# EAGLE design Adafruit NeoTrellis 4x4 (EAGLE 9.1.1)
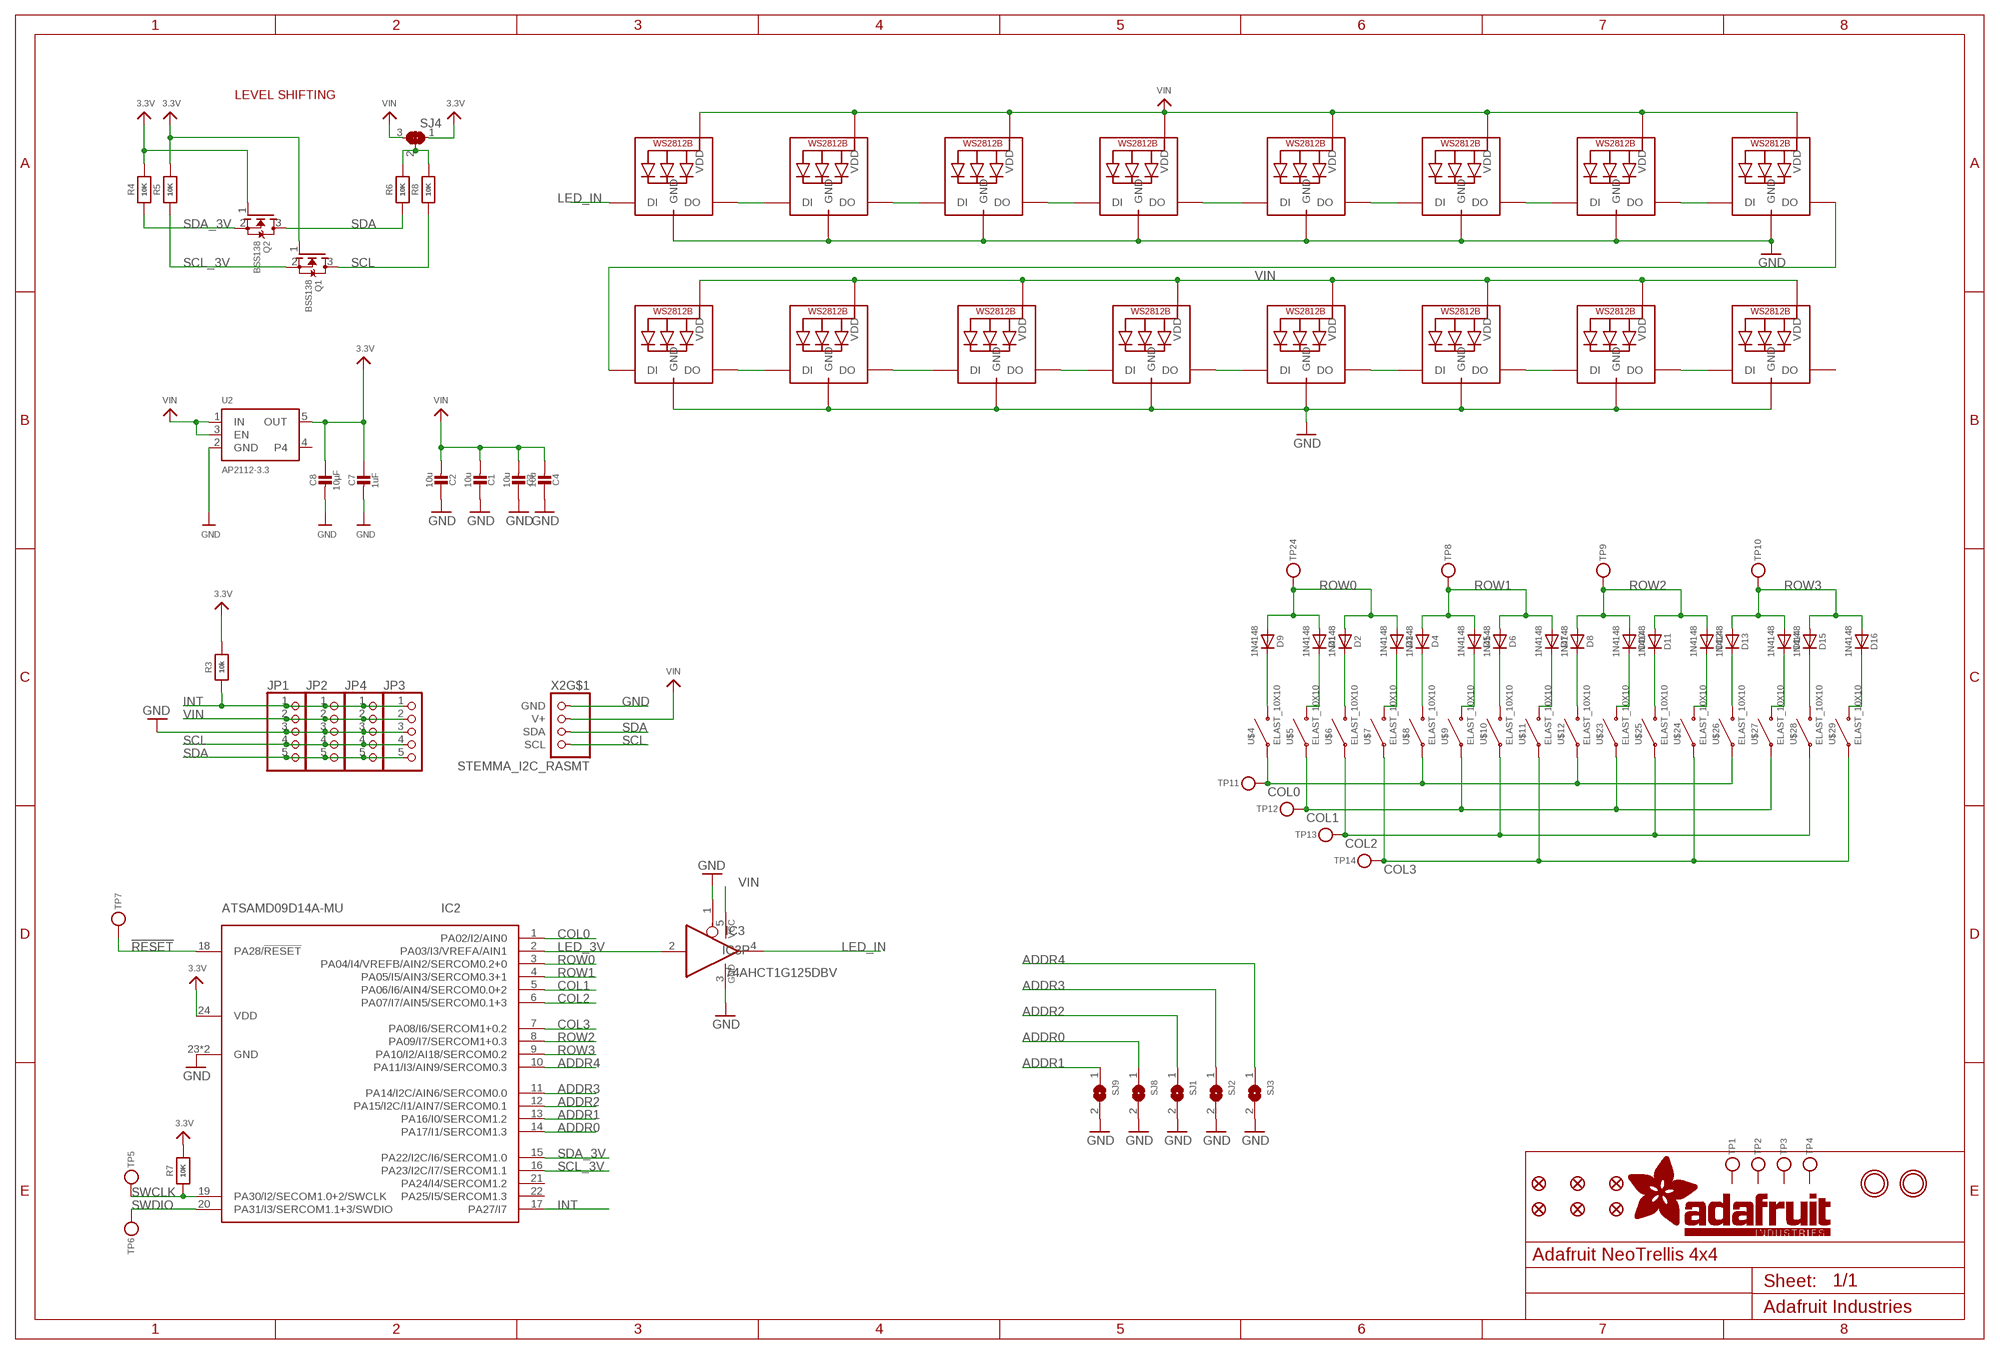
[diagram p0: schematic, sheet 1]

## Parts
C1  10u  CAP_CERAMIC0805-NOOUTLINE  [0805-NO]
C2  10u  CAP_CERAMIC0805-NOOUTLINE  [0805-NO]
C3  10u  CAP_CERAMIC0805-NOOUTLINE  [0805-NO]
C4  10u  CAP_CERAMIC0805-NOOUTLINE  [0805-NO]
C7  1uF  CAP_CERAMIC0603_NO  [0603-NO]
C8  10µF  CAP_CERAMIC0805-NOOUTLINE  [0805-NO]
D1  1N4148  DIODESOD-323  [SOD-323]
D2  1N4148  DIODESOD-323  [SOD-323]
D3  1N4148  DIODESOD-323  [SOD-323]
D4  1N4148  DIODESOD-323  [SOD-323]
D5  1N4148  DIODESOD-323  [SOD-323]
D6  1N4148  DIODESOD-323  [SOD-323]
D7  1N4148  DIODESOD-323  [SOD-323]
D8  1N4148  DIODESOD-323  [SOD-323]
D9  1N4148  DIODESOD-323  [SOD-323]
D10  1N4148  DIODESOD-323  [SOD-323]
D11  1N4148  DIODESOD-323  [SOD-323]
D12  1N4148  DIODESOD-323  [SOD-323]
D13  1N4148  DIODESOD-323  [SOD-323]
D14  1N4148  DIODESOD-323  [SOD-323]
D15  1N4148  DIODESOD-323  [SOD-323]
D16  1N4148  DIODESOD-323  [SOD-323]
FID1  FIDUCIAL_1MM  [FIDUCIAL_1MM]
FID2  FIDUCIAL_1MM  [FIDUCIAL_1MM]
FID3  FIDUCIAL_1MM  [FIDUCIAL_1MM]
FID4  FIDUCIAL_1MM  [FIDUCIAL_1MM]
FID5  FIDUCIAL_1MM  [FIDUCIAL_1MM]
FID6  FIDUCIAL_1MM  [FIDUCIAL_1MM]
IC2  ATSAMD09D14A-MU  [QFN24_4MM]
IC3  74AHCT1G125DBV  [SOT23-5]
JP1  HEADER-1X5EDGESMT  [5P_EDGECONNECT]
JP2  HEADER-1X5EDGESMT  [5P_EDGECONNECT]
JP3  HEADER-1X5EDGESMT  [5P_EDGECONNECT]
JP4  HEADER-1X5EDGESMT  [5P_EDGECONNECT]
LED1  WS2812B3535  [LED3535]
LED2  WS2812B3535  [LED3535]
LED3  WS2812B3535  [LED3535]
LED4  WS2812B3535  [LED3535]
LED5  WS2812B3535  [LED3535]
LED6  WS2812B3535  [LED3535]
LED7  WS2812B3535  [LED3535]
LED8  WS2812B3535  [LED3535]
LED9  WS2812B3535  [LED3535]
LED10  WS2812B3535  [LED3535]
LED11  WS2812B3535  [LED3535]
LED12  WS2812B3535  [LED3535]
LED13  WS2812B3535  [LED3535]
LED14  WS2812B3535  [LED3535]
LED15  WS2812B3535  [LED3535]
LED16  WS2812B3535  [LED3535]
Q1  BSS138  MOSFET-NWIDE  [SOT23-WIDE]
Q2  BSS138  MOSFET-NWIDE  [SOT23-WIDE]
R3  10k  RESISTOR_0603_NOOUT  [0603-NO]
R4  10K  RESISTOR_0603_NOOUT  [0603-NO]
R5  10K  RESISTOR_0603_NOOUT  [0603-NO]
R6  10K  RESISTOR_0603_NOOUT  [0603-NO]
R7  10K  RESISTOR_0603_NOOUT  [0603-NO]
R8  10K  RESISTOR_0603_NOOUT  [0603-NO]
SJ1  SOLDERJUMPER  [SOLDERJUMPER_ARROW_NOPASTE]
SJ2  SOLDERJUMPER  [SOLDERJUMPER_ARROW_NOPASTE]
SJ3  SOLDERJUMPER  [SOLDERJUMPER_ARROW_NOPASTE]
SJ4  SOLDERJUMPER_2WAY  [SOLDERJUMPER_2WAY_OPEN_NOPASTE]
SJ8  SOLDERJUMPER  [SOLDERJUMPER_ARROW_NOPASTE]
SJ9  SOLDERJUMPER  [SOLDERJUMPER_ARROW_NOPASTE]
TP1  TESTPOINT  [TESTPOINT_SMT]
TP2  TESTPOINT  [TESTPOINT_SMT]
TP3  TESTPOINT  [TESTPOINT_SMT]
TP4  TESTPOINT  [TESTPOINT_SMT]
TP5  TESTPOINTROUND2MM  [TESTPOINT_ROUND_2MM]
TP6  TESTPOINTROUND2MM  [TESTPOINT_ROUND_2MM]
TP7  TESTPOINTROUND1.5MM  [TESTPOINT_ROUND_1.5MM]
TP8  TESTPOINTROUND1.5MM  [TESTPOINT_ROUND_1.5MM]
TP9  TESTPOINTROUND1.5MM  [TESTPOINT_ROUND_1.5MM]
TP10  TESTPOINTROUND1.5MM  [TESTPOINT_ROUND_1.5MM]
TP11  TESTPOINTROUND1.5MM  [TESTPOINT_ROUND_1.5MM]
TP12  TESTPOINTROUND1.5MM  [TESTPOINT_ROUND_1.5MM]
TP13  TESTPOINTROUND1.5MM  [TESTPOINT_ROUND_1.5MM]
TP14  TESTPOINTROUND1.5MM  [TESTPOINT_ROUND_1.5MM]
TP24  TESTPOINTROUND1.5MM  [TESTPOINT_ROUND_1.5MM]
U2  AP2112-3.3  VREG_SOT23-5  [SOT23-5]
U$1  MOUNTINGHOLE2.5  [MOUNTINGHOLE_2.5_PLATED]
U$2  MOUNTINGHOLE2.5  [MOUNTINGHOLE_2.5_PLATED]
U$4  ELAST_10X10  [ELAST_PAD_SQUARE_10MM_4X4WIDE]
U$5  ELAST_10X10  [ELAST_PAD_SQUARE_10MM_4X4WIDE]
U$6  ELAST_10X10  [ELAST_PAD_SQUARE_10MM_4X4WIDE]
U$7  ELAST_10X10  [ELAST_PAD_SQUARE_10MM_4X4WIDE]
U$8  ELAST_10X10  [ELAST_PAD_SQUARE_10MM_4X4WIDE]
U$9  ELAST_10X10  [ELAST_PAD_SQUARE_10MM_4X4WIDE]
U$10  ELAST_10X10  [ELAST_PAD_SQUARE_10MM_4X4WIDE]
U$11  ELAST_10X10  [ELAST_PAD_SQUARE_10MM_4X4WIDE]
U$12  ELAST_10X10  [ELAST_PAD_SQUARE_10MM_4X4WIDE]
U$23  ELAST_10X10  [ELAST_PAD_SQUARE_10MM_4X4WIDE]
U$24  ELAST_10X10  [ELAST_PAD_SQUARE_10MM_4X4WIDE]
U$25  ELAST_10X10  [ELAST_PAD_SQUARE_10MM_4X4WIDE]
U$26  ELAST_10X10  [ELAST_PAD_SQUARE_10MM_4X4WIDE]
U$27  ELAST_10X10  [ELAST_PAD_SQUARE_10MM_4X4WIDE]
U$28  ELAST_10X10  [ELAST_PAD_SQUARE_10MM_4X4WIDE]
U$29  ELAST_10X10  [ELAST_PAD_SQUARE_10MM_4X4WIDE]
X2  STEMMA_I2C_RASMT  [JSTPH4]

## Nets
3.3V: C7.1 C8.1 IC2.24(VDD) Q1.1(G) Q2.1(G) R3.2 R4.2 R5.2 R7.2 SJ4.1 U2.5(OUT)
!RESET: IC2.18(PA28/!RESET) TP7.P$1
ADDR0: IC2.14(PA17/I1/SERCOM1.3) SJ8.1
ADDR1: IC2.13(PA16/I0/SERCOM1.2) SJ9.1
ADDR2: IC2.12(PA15/I2C/I1/AIN7/SERCOM0.1) SJ1.1
ADDR3: IC2.11(PA14/I2C/AIN6/SERCOM0.0) SJ2.1
ADDR4: IC2.10(PA11/I3/AIN9/SERCOM0.3) SJ3.1
COL0: IC2.1(PA02/I2/AIN0) TP11.P$1 U$4.P$1 U$8.P$1 U$12.P$1 U$26.P$1
COL1: IC2.5(PA06/I6/AIN4/SERCOM0.0+2) TP12.P$1 U$5.P$1 U$9.P$1 U$23.P$1 U$27.P$1
COL2: IC2.6(PA07/I7/AIN5/SERCOM0.1+3) TP13.P$1 U$6.P$1 U$10.P$1 U$25.P$1 U$28.P$1
COL3: IC2.7(PA08/I6/SERCOM1+0.2) TP14.P$1 U$7.P$1 U$11.P$1 U$24.P$1 U$29.P$1
GND: C1.1 C2.1 C3.1 C4.1 C7.2 C8.2 IC2.23(GND) IC2.THERM(GND) IC3.1(OE) IC3.3(GND) JP1.3 JP2.3 JP3.3 JP4.3 LED1.4(GND) LED2.4(GND) LED3.4(GND) LED4.4(GND) LED5.4(GND) LED6.4(GND) LED7.4(GND) LED8.4(GND) LED9.4(GND) LED10.4(GND) LED11.4(GND) LED12.4(GND) LED13.4(GND) LED14.4(GND) LED15.4(GND) LED16.4(GND) SJ1.2 SJ2.2 SJ3.2 SJ8.2 SJ9.2 U2.2(GND) X2.1(GND)
INT: IC2.17(PA27/I7) JP1.1 JP2.1 JP3.1 JP4.1 R3.1
LED_3V: IC2.2(PA03/I3/VREFA/AIN1) IC3.2(I)
LED_IN: IC3.4(O) LED1.1(DI)
N$1: R6.2 R8.2 SJ4.2
N$2: D9.C U$4.P$2
N$3: D1.C U$5.P$2
N$4: D2.C U$6.P$2
N$5: D3.C U$7.P$2
N$6: D4.C U$8.P$2
N$9: D5.C U$9.P$2
N$11: LED1.3(DO) LED2.1(DI)
N$12: LED2.3(DO) LED3.1(DI)
N$13: LED3.3(DO) LED4.1(DI)
N$14: LED4.3(DO) LED5.1(DI)
N$15: D6.C U$10.P$2
N$16: LED5.3(DO) LED6.1(DI)
N$17: LED6.3(DO) LED7.1(DI)
N$18: D7.C U$11.P$2
N$19: LED7.3(DO) LED8.1(DI)
N$20: D8.C U$12.P$2
N$21: LED8.3(DO) LED9.1(DI)
N$22: D10.C U$23.P$2
N$23: D11.C U$25.P$2
N$24: D12.C U$24.P$2
N$25: D13.C U$26.P$2
N$26: D14.C U$27.P$2
N$27: D15.C U$28.P$2
N$28: D16.C U$29.P$2
N$29: LED9.3(DO) LED10.1(DI)
N$30: LED10.3(DO) LED12.1(DI)
N$31: LED11.1(DI) LED12.3(DO)
N$32: LED11.3(DO) LED13.1(DI)
N$33: LED13.3(DO) LED14.1(DI)
N$34: LED14.3(DO) LED15.1(DI)
N$35: LED15.3(DO) LED16.1(DI)
ROW0: D1.A D2.A D3.A D9.A IC2.3(PA04/I4/VREFB/AIN2/SERCOM0.2+0) TP24.P$1
ROW1: D4.A D5.A D6.A D7.A IC2.4(PA05/I5/AIN3/SERCOM0.3+1) TP8.P$1
ROW2: D8.A D10.A D11.A D12.A IC2.8(PA09/I7/SERCOM1+0.3) TP9.P$1
ROW3: D13.A D14.A D15.A D16.A IC2.9(PA10/I2/AI18/SERCOM0.2) TP10.P$1
SCL: JP1.4 JP2.4 JP3.4 JP4.4 Q1.3(D) R8.1 X2.4(SCL)
SCL_3V: IC2.16(PA23/I2C/I7/SERCOM1.1) Q1.2(S) R5.1
SDA: JP1.5 JP2.5 JP3.5 JP4.5 Q2.3(D) R6.1 X2.3(SDA)
SDA_3V: IC2.15(PA22/I2C/I6/SERCOM1.0) Q2.2(S) R4.1
SWCLK: IC2.19(PA30/I2/SECOM1.0+2/SWCLK) R7.1 TP5.P$1
SWDIO: IC2.20(PA31/I3/SERCOM1.1+3/SWDIO) TP6.P$1
VIN [power]: C1.2 C2.2 C3.2 C4.2 IC3.5(VCC) JP1.2 JP2.2 JP3.2 JP4.2 LED1.2(VDD) LED2.2(VDD) LED3.2(VDD) LED4.2(VDD) LED5.2(VDD) LED6.2(VDD) LED7.2(VDD) LED8.2(VDD) LED9.2(VDD) LED10.2(VDD) LED11.2(VDD) LED12.2(VDD) LED13.2(VDD) LED14.2(VDD) LED15.2(VDD) LED16.2(VDD) SJ4.3 U2.1(IN) U2.3(EN) X2.2(V+)
Unconnected: IC2.21(PA24/I4/SERCOM1.2) IC2.22(PA25/I5/SERCOM1.3) LED16.3(DO) TP1.P$1 TP2.P$1 TP3.P$1 TP4.P$1 U2.4 X2.NC1(MT) X2.NC2(MT)

## Notes on the sheet
- LEVEL SHIFTING

## Library data of the parts
C1-C4 C7 C8 = microbuilder:CAP_CERAMIC: Ceramic Capacitors For new designs, use the packages preceded by an '_' character since they are more reliable: The following footprints should be used on most boards: _0402 - Standard footprint for regular board layouts _0603 - Standard footprint for regular board layouts _0805 - Standard footprint for regular board layouts _1206 - Standard footprint for regular board layouts For extremely tight-pitch boards where space is at a premium, the following 'micro-pitch' footprints can be used (smaller pads, no silkscreen outline, etc.): _0402MP - Micro-pitch footprint for very dense/compact boards _0603MP - Micro-pitch footprint for very dense/compact boards _0805MP - Micro-pitch footprint for very dense/compact boards _1206MP - Micro-pitch footprint for very dense/compact boards
D1-D16 = microbuilder:DIODE: Diode SMA Model Volts Amps Type Vf Ir Digikey # Notes SSA34-E3 40V 3A Schottky 480mV @ 3A 200uA @ 40V SSA34-E3/61TGITR-ND CDBA120-G 20V 1A Schottky 500mV @ 1A 500uA @ 20V 641-1014-6-ND REEL MBRA210 10V 2A Schottky 350mV @ 2A 700uA @ 10V MBRA210LT3 SOD-123 Model Volts Amps Type Vf Ir Order # Notes BAT54T1G 30V 200mA Schottky 800mV @ 200mA 2uA @ 25V BAT54T1GOSTR-ND B0530W 30V 500mA Schottky 430mV @ 500mA 130uA @ 30V B0530W-FDICT-ND REEL MBR120 20V 1A Schottky 340mV @ 1A MBR120VLSFT1GOSCT-ND SOD-323 Model Volts Amps Type Vf Ir Order # Notes PMEG2005EJ 20V 500mA Schottky 355mV @ 500mA 568-4110-1-ND ZLLS410 10V 570mA Schottky 380mV @ 570mA ZLLS410CT-ND 1N4148WS 75V 150mA Silicon/Simple 1V 1N4148WSFSCT-ND REEL SOD-523 Model Volts Amps Type Vf Ir Order # Notes BAT54XV2 30V 200mA Schottky 0.8V @ 100mA BAT54XV2CT-ND TB751S 30V 30mA Schottky RB751S-40TE61CT-ND SOT23-R/W (R = Solder Paste/Reflow Ovens, W = Hand-Soldering) Model Volts Amps Type Vf Ir Order # Notes BAT54FILM 40V 300mA Schottky 497-7162-1-ND POWERDI-5 Model Volts Amps Type Vf Ir Order # Notes PDS560 60V 5A Schottky 670mV @ 5A 150uA @ 60V PDS560DICT-ND
FID1-FID6 = microbuilder:FIDUCIAL: Fiducial Alignment Points Various fiducial points for machine vision alignment.; BOM: EXCLUDE
IC2 = microbuilder:ATSAMD09D14A
IC3 = 74xx-little-us:74*1G125: Single Bus Buffer Gate with 3-State Output
JP1-JP4 = microbuilder:HEADER-1X5: PIN HEADER
LED1-LED16 = microbuilder:WS2812B
Q1 Q2 = microbuilder:MOSFET-N: N-Channel Mosfet LEGEND VDS: Voltage Drain-Source ID: Drain Current RDS(ON): Drain-Source On-State Resistance VGS(TH): Gate-Source Threshold Voltage CISS: Drain-Source Input Capacitance SOT-23 Name VDS ID RDS(ON) VGS(TH) CISS Order Number 2N7002E 60V 260mA 2.5 Ohm 2.5V @ 250uA 26.7pF @ 25V 2N7002ET1GOSTR-ND BSH103 30V 850mA 400 mOhm 400mV @ 1mA 83pF @ 24V BSH103,235-ND BSS138 60V 320mA 1.6 Ohm 1.5V @ 250uA 50pF @ 10V Mouser: 771-BSS138PW115 DMN2075U-7 20V 4.2A 38 mOhm 1V @ 250 uA 594.3pF @ 10V DMN2075U-7DICT-ND * BSS138 good choice for I2C level-shifting POWERPAK 1212-8 Name VDS ID RDS(ON) VGS(TH) CISS Order Number Si7308DN 60V 6A 58 mOhm 3V @ 250uA 665pF @ 15V SI7308DN-T1-E3CT-ND
R3-R8 = microbuilder:RESISTOR: Resistors For new designs, use the packages preceded by an '_' character since they are more reliable: The following footprints should be used on most boards: _0402 - Standard footprint for regular board layouts _0603 - Standard footprint for regular board layouts _0805 - Standard footprint for regular board layouts _1206 - Standard footprint for regular board layouts For extremely tight-pitch boards where space is at a premium, the following 'micro-pitch' footprints can be used (smaller pads, no silkscreen outline, etc.): _0402MP - Micro-pitch footprint for very dense/compact boards _0603MP - Micro-pitch footprint for very dense/compact boards _0805MP - Micro-pitch footprint for very dense/compact boards _1206MP - Micro-pitch footprint for very dense/compact boards
SJ1-SJ3 SJ8 SJ9 = microbuilder:SOLDERJUMPER: SMD Solder JUMPER Solder the two pads together to create a connection, or remove the solder to break it. REFLOW - Use this footprint for solder paste and reflow ovens. WAVE - Use this footprint for hand-soldering (larger pads). CLOSED - Has a trace between the two pads to ensure it is closed by default. The trace needs to be cut to disable the jumper, and can be closed again by creating a solder bridge between the two pads.; BOM: EXCLUDE
SJ4 = microbuilder:SOLDERJUMPER_2WAY: 2-Way Solder Jumper
TP1-TP14 TP24 = microbuilder:TESTPOINT: Test Point Various test points for characterisation and PCB testing TESTPOINT_SMT - Compact Surface Mount Test Point [Digikey: 5016KTR-ND]
U2 = microbuilder:VREG_SOT23-5: SOT23-5 Fixed Voltage Regulators Part Current Out V Out V In V Dropout θJA (°C/W) TJ (°C) Digikey Part No. ADP121 150mA 3.3V 3.4-5.5V 0.09V @ 150mA -- -- ADP121-AUJZ33R7CT-ND ADP121 150mA 3.0V 3.1-5.5V 0.09V @ 150mA -- -- ADP121-AUJZ30R7CT-ND ADP122 300mA 3.3V 3.4-5.5V 0.085V @ 300mA -- -- ADP122AUJZ-3.3-R7CT-ND ADP1712 300mA 3.3V 3.5-5.5V 0.17V @ 300mA -- -- ADP1712AUJZ-3.3-R7TR-ND AP7311 (Low Cost) 150mA 3.3V 3.5-6V 0.15V @ 150mA -- -- AP7311-33WG-7DICT-ND LD39015M18R 150mA 1.8V 1.9V-5.5V 0.08V @ 100mA -- -- 497-6977-1-ND LP2985A-33DBVR 150mA 3.3V 3.3-16V 0.28V @ 150mA 206 150 296-18479-1-ND MCP1824T-3302E/OT 300mA 3.3V 3.5V-6V 0.2V @ 300mA -- -- MCP1824T-3302E/OTCT-ND MIC5205-2.5YM5 TR 150mA 2.5V 2.7-16V 0.165V @ 150mA -- -- 576-1257-2-ND MIC5205-3.0YM5 TR 150mA 3.0V 3.2V-16V 0.165V @ 150mA -- -- 576-1258-2-ND MIC5205-3.3YM5 TR 150mA 3.3V 3.5V-16V 0.165V @ 150mA -- -- 576-1259-2-ND TPS780330220 150mA 3.3V+2.2V 3.6-5.5V 250mV Max -- -- 296-23332-1-ND TDA3663/N1,135 100mA 3.3V 3.5-45V 0.18V @ 50mA -- -- 568-5343-1-ND Max operating temp can be calculated using θJA, TJ (max junction temperature), and power in watts. Set the "Maximum Ambient Temperature" until it reaches TJ ("Max Junction Temperature"), which is the absolute limit for safe use of the regulator: Heat Sink Temperature Calculator <http://www.daycounter.com/Calculators/Heat-Sink-Temperature-Calculator.phtml> For example, With 12V source into a 3.3V LP2985 and a 30mA load, we are dissipating (12V-3.3V) * 0.03A = 0.261W. With a θJA of 206 °C/W, a TJ of 150°C, and 261mW we can safely use the chip without a heat sink up to 75°C (=147.1°C Junction Temperature).
U$1 U$2 = microbuilder:MOUNTINGHOLE: Mounting Hole For #2 screws (0.086"/2.18mm width, 0.094"/2.4mm hole) use 2.5mm; BOM: EXCLUDE
U$4-U$12 U$23-U$29 = microbuilder:ELAST_10X10: 10mm x 10mm elastomer pad
X2 = microbuilder:STEMMA_I2C

## Net classes
1 power: width 0.406 mm
2 gnd: width 0.254 mm

## Board
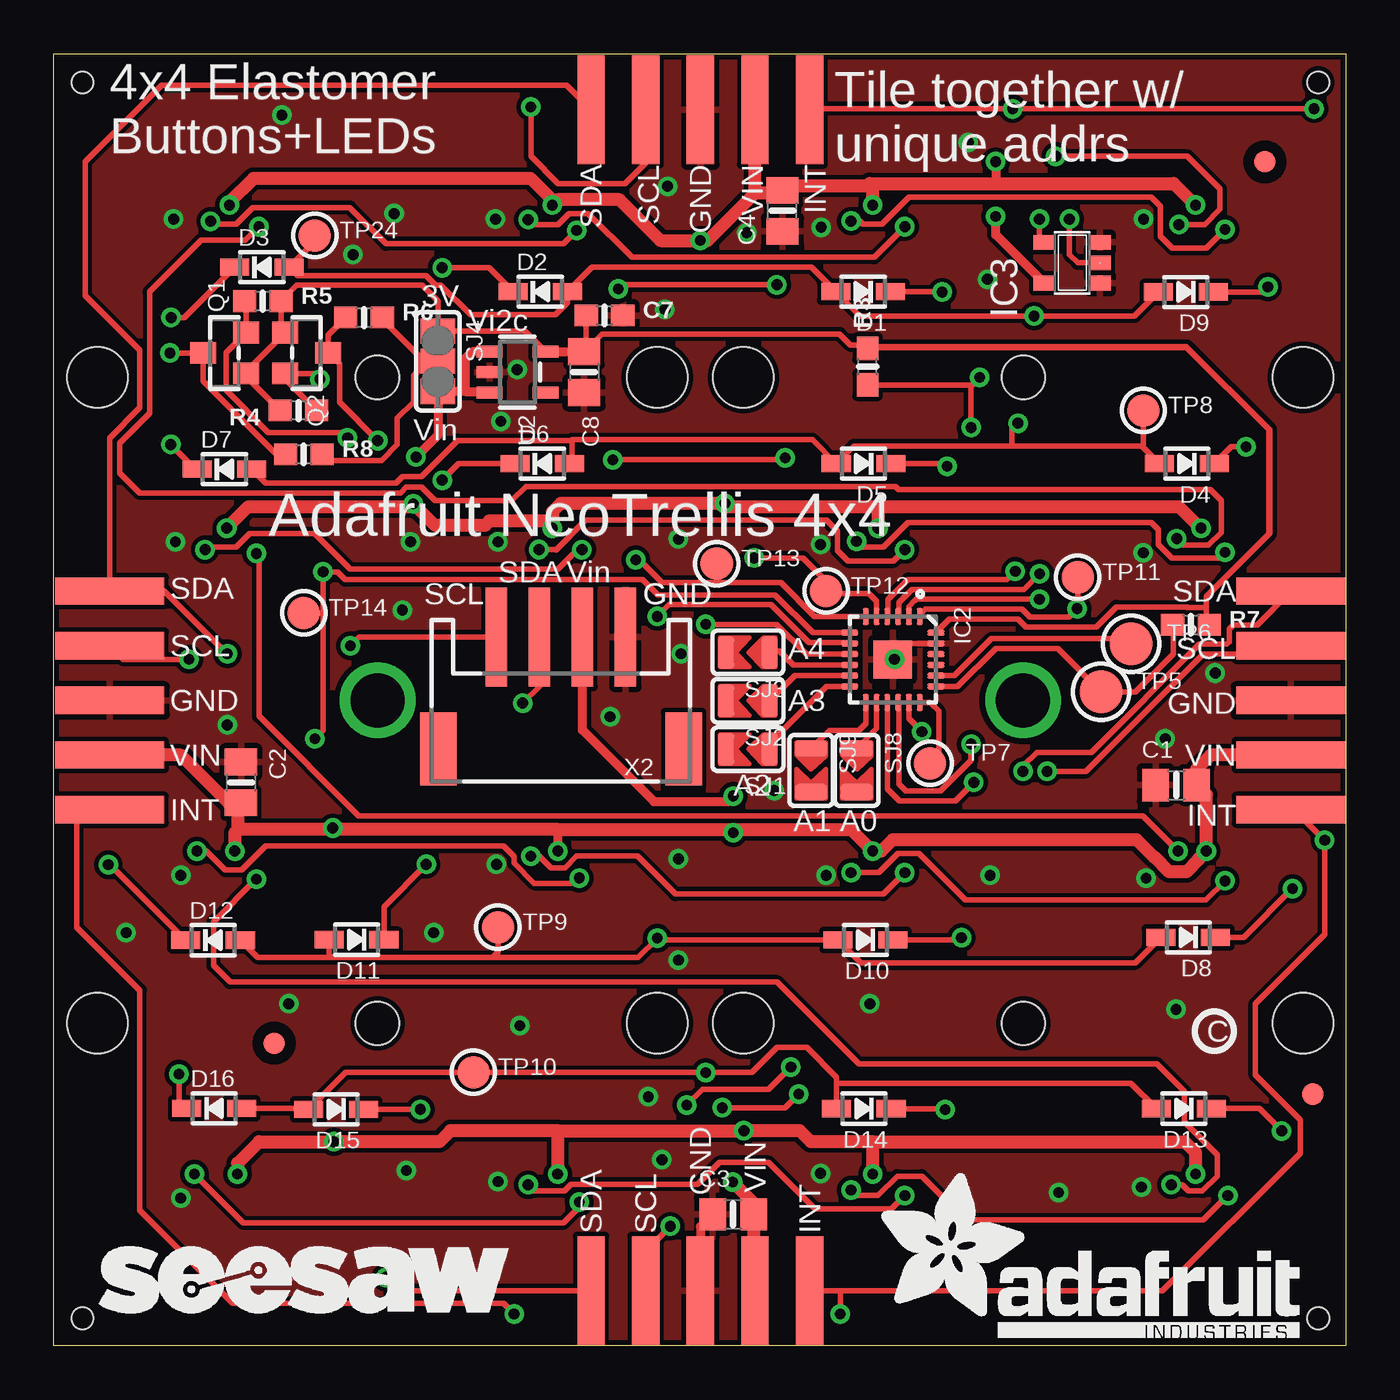
[diagram p1: board, top side]
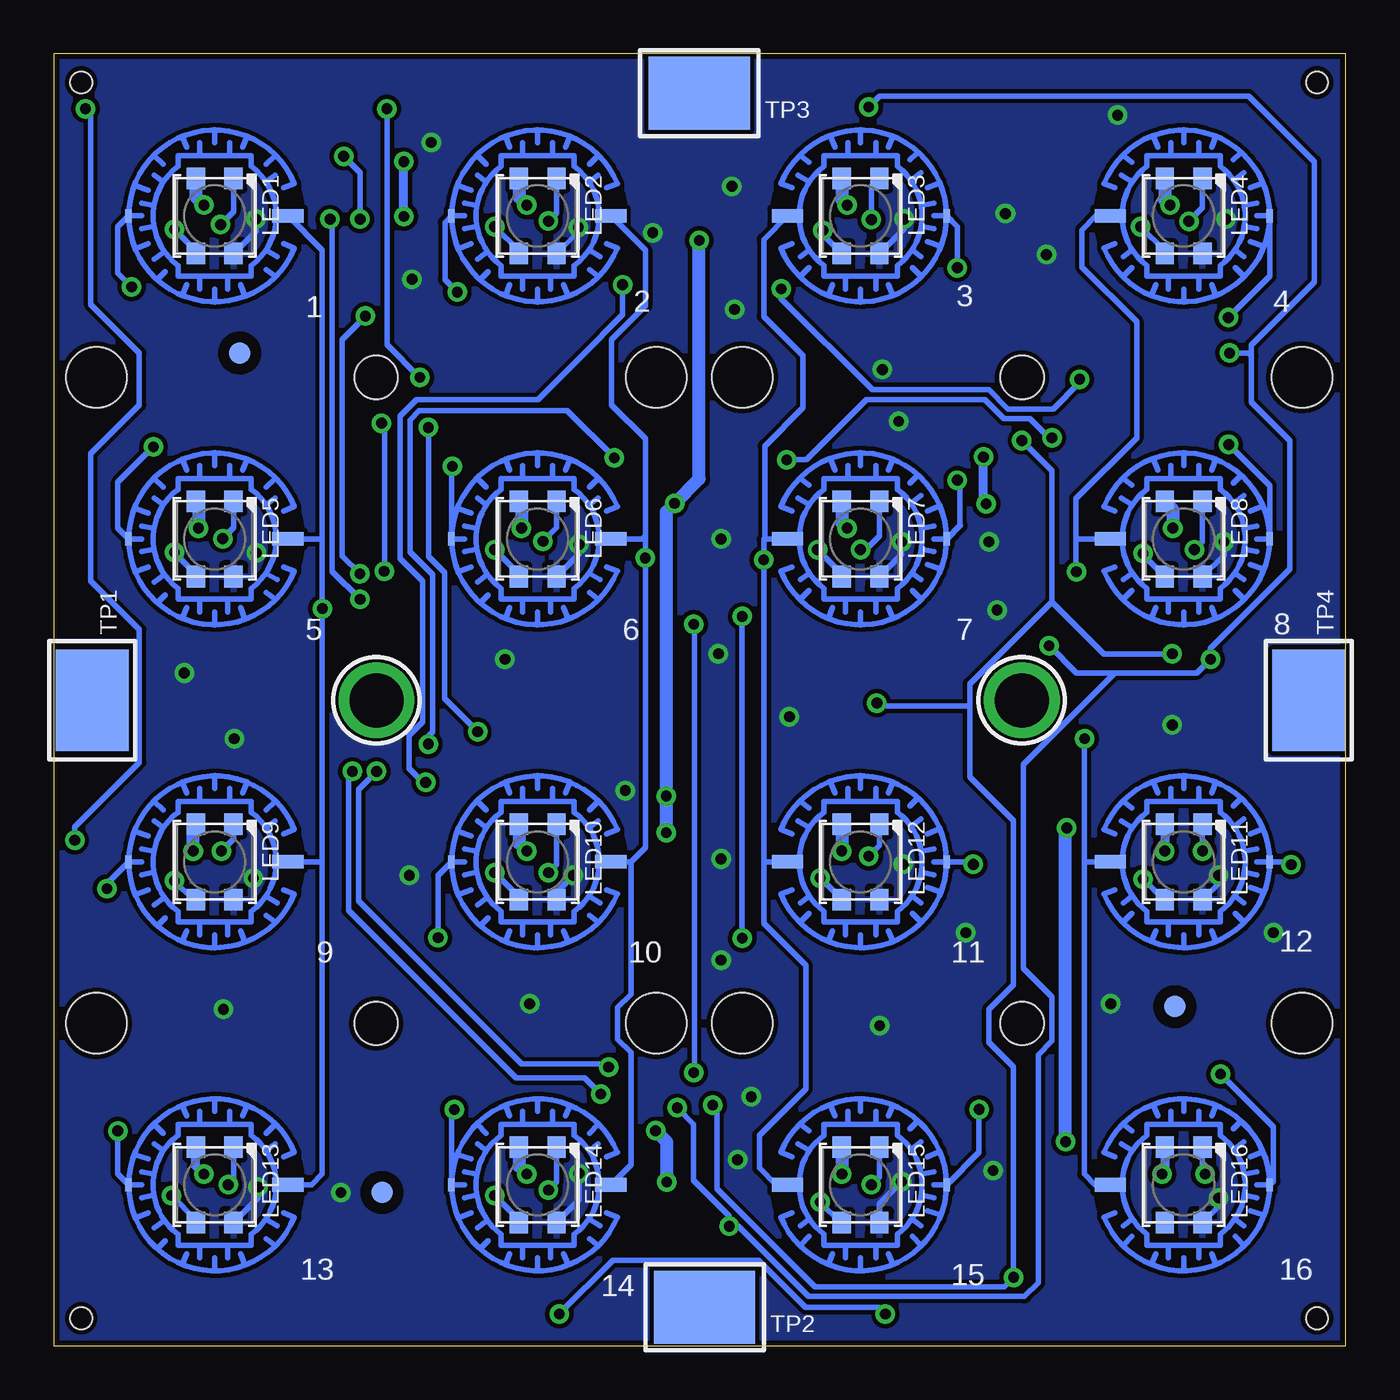
[diagram p2: board, bottom side, seen from below]

Size 60 x 60 mm. Coordinates in mm from the lower left corner, seen from the top.
Outline: 60,0 0,0 0,60 60,60 60,0
Copper layers (1*16): Top 0.035mm / dielectric 1.5mm / Bottom 0.035mm
Design rules "adafruit 88 *": minimum track width 8mil, minimum drill 15.5mil, track to track 8mil, track to pad 8mil, pad to pad 8mil, via to via 8mil, smd to smd 8mil, copper to edge 10mil, drill to drill 8mil, minimum pad ring 10mil, minimum via ring 8mil, stop-mask expansion 2mil, vias tented up to drill 20mil, thermal gap 10mil
Holes 2.8 mm at 2.03,44.97 28.03,44.97 32.03,44.97 58.03,44.97 2.03,14.97 28.03,14.97 32.03,14.97 58.03,14.97
Holes 2 mm at 15.03,44.97 45.03,44.97 15.03,14.97 45.03,14.97
Holes 1 mm at 1.33,58.67 58.73,58.67 1.33,1.27 58.73,1.27

### Footprints (pad centres in the part's own frame; a part is rotated, then mirrored left to right if it is on the bottom)
0805-NO = smd 1.24 x 1.5: 1 -0.95,0; 2 0.95,0
0603-NO = smd 1.075 x 1: 1 -0.85,0; 2 0.85,0
SOD-323 = smd 1.35 x 0.8: A 1.27,0; C -1.27,0
FIDUCIAL_1MM = smd 1 x 1: 1 0,0
QFN24_4MM = smd 0.8 x 0.28: 1 -2,1.25; 2 -2,0.75; 3 -2,0.25; 4 -2,-0.25; 5 -2,-0.75; 6 -2,-1.25; 13 2,-1.25; 14 2,-0.75; 15 2,-0.25; 16 2,0.25; 17 2,0.75; 18 2,1.25 | smd 0.28 x 0.8: 7 -1.25,-2; 8 -0.75,-2; 9 -0.25,-2; 10 0.25,-2; 11 0.75,-2; 12 1.25,-2; 19 1.25,2; 20 0.75,2; 21 0.25,2; 22 -0.25,2; 23 -0.75,2; 24 -1.25,2 | smd 1.778 x 1.778: THERM 0,0
SOT23-5 = smd 0.69 x 0.99: 1 -0.95,-1.29; 2 0,-1.29; 3 0.95,-1.29; 4 0.95,1.3; 5 -0.95,1.3
5P_EDGECONNECT = smd 1.27 x 5.08: 1 -5.08,0; 2 -2.54,0; 3 0,0; 4 2.54,0; 5 5.08,0
LED3535 = smd 1 x 0.85: 1 -1.75,0.875; 2 -1.75,-0.875; 3 1.75,-0.875; 4 1.75,0.875
SOT23-WIDE = smd 1 x 1.2: 1 -0.95,-1; 2 0.95,-1; 3 0,1
SOLDERJUMPER_ARROW_NOPASTE = smd 0.762 x 1.524: 1 -1.016,0; 2 1.016,0
SOLDERJUMPER_2WAY_OPEN_NOPASTE = smd 1.168 x 1.6: 1 -1.397,0; 2 0,0; 3 1.397,0
TESTPOINT_SMT = smd 4.7 x 3.4: P$1 0,0
TESTPOINT_ROUND_2MM = smd 2 x 2: P$1 0,0
TESTPOINT_ROUND_1.5MM = smd 1.5 x 1.5: P$1 0,0
SOT23-5' = smd 0.55 x 1.2: 1 -0.95,-1.3; 2 0,-1.3; 3 0.95,-1.3; 4 0.95,1.3; 5 -0.95,1.3
MOUNTINGHOLE_2.5_PLATED = drill 2.5 pad 3.2: P$1 0,0
ELAST_PAD_SQUARE_10MM_4X4WIDE = smd 1.45 x 0.635: P$1 -3.4,0 | smd 0.305 x 0.61: P$2 4,0
JSTPH4 = smd 1 x 4.6: 1 -3,-3.7; 2 -1,-3.7; 3 1,-3.7; 4 3,-3.7 | smd 1.7 x 3.4: NC1 -5.7,1.5; NC2 5.7,1.5

### Placement (x,y rotation side)
C1  52.13,26.04 0 top
C2  8.69,26.16 270 top
C3  31.55,6.1 0 top
C4  33.84,52.7 90 top
C7  25.58,47.85 0 top
C8  24.63,45.22 270 top
D1  37.59,48.95 180 top
D2  22.59,48.95 0 top
D3  9.66,50.09 0 top
D4  52.62,40.96 180 top
D5  37.61,40.96 180 top
D6  22.69,40.96 0 top
D7  7.92,40.71 0 top
D8  52.68,18.97 180 top
D9  52.58,48.94 180 top
D10  37.7,18.84 180 top
D11  14.06,18.86 180 top
D12  7.4,18.83 0 top
D13  52.48,11.01 180 top
D14  37.62,11.01 180 top
D15  13.11,10.98 180 top
D16  7.45,11.02 0 top
FID1  10.23,14.05 0 top
FID2  58.48,11.68 0 top
FID3  56.25,54.98 0 top
FID4  51.36,46.1 0 bottom
FID5  44.76,7.11 0 bottom
FID6  7.93,15.75 0 bottom
IC2  38.96,31.87 270 top
IC3  47.3,50.29 90 top
JP1  2.6,29.97 90 top
JP2  57.46,29.97 90 top
JP3  30.03,2.54 180 top
JP4  30.03,57.4 180 top
LED1  52.53,52.47 270 bottom
LED2  37.53,52.47 270 bottom
LED3  22.53,52.47 270 bottom
LED4  7.53,52.47 270 bottom
LED5  52.53,37.47 270 bottom
LED6  37.53,37.47 270 bottom
LED7  22.53,37.47 270 bottom
LED8  7.53,37.47 270 bottom
LED9  52.53,22.47 270 bottom
LED10  37.53,22.47 270 bottom
LED11  7.53,22.47 270 bottom
LED12  22.53,22.47 270 bottom
LED13  52.53,7.47 270 bottom
LED14  37.53,7.47 270 bottom
LED15  22.53,7.47 270 bottom
LED16  7.53,7.47 270 bottom
Q1  7.93,46.1 90 top
Q2  11.74,46.1 270 top
R3  37.8,45.47 90 top
R4  11.36,43.43 180 top
R5  9.71,48.51 0 top
R6  14.41,47.75 0 top
R7  52.81,33.48 0 top
R8  11.61,41.4 0 top
SJ1  32.23,27.71 180 top
SJ2  32.23,29.96 180 top
SJ3  32.23,32.2 180 top
SJ4  17.84,45.72 270 top
SJ8  37.29,26.72 270 top
SJ9  35.17,26.72 270 top
TP1  58.22,29.97 90 bottom
TP2  29.77,1.78 0 bottom
TP3  30.03,58.17 0 bottom
TP4  1.71,29.97 90 bottom
TP5  48.64,30.37 0 top
TP6  50.04,32.61 0 top
TP7  40.7,27.05 0 top
TP8  50.6,43.43 0 top
TP9  20.63,19.43 0 top
TP10  19.49,12.7 0 top
TP11  47.55,35.69 0 top
TP12  35.87,35.05 0 top
TP13  30.79,36.32 0 top
TP14  11.61,34.04 0 top
TP24  12.12,51.56 0 top
U2  AP2112-3.3  [SOT23-5']  21.53,45.22 270 top
U$1  45.01,29.97 0 bottom
U$2  15.04,29.97 0 bottom
U$3  [ADAFRUIT_TEXT_20MM]  38.28,0.38 0 top
U$4  52.53,52.47 180 bottom
U$5  37.53,52.47 180 bottom
U$6  22.53,52.47 0 bottom
U$7  7.53,52.47 0 bottom
U$8  52.53,37.47 180 bottom
U$9  37.53,37.47 180 bottom
U$10  22.53,37.47 0 bottom
U$11  7.53,37.47 0 bottom
U$12  52.53,22.47 180 bottom
U$14  [SEESAW_LOGO]  2.09,1.52 0 top
U$19  [PCBFEAT-REV-040]  53.9,14.61 0 top
U$23  37.53,22.47 180 bottom
U$24  7.53,22.47 0 bottom
U$25  22.53,22.47 0 bottom
U$26  52.53,7.47 180 bottom
U$27  37.53,7.47 180 bottom
U$28  22.53,7.47 0 bottom
U$29  7.53,7.47 0 bottom
X2  23.55,29.21 180 top

### Tracks (layer width: path | path; a pad name or v marks a point on that pad's centre or on a via)
3.3V
  Top 0.203: R3.2 37.85,46.38 38.03,46.38
  Top 0.254: R4.2 8.93,45.01 Q1.1 8.84,45.15 Q2.1 10.56,47.23 R5.2 11.29,49.25 17.09,49.25 17.84,48.5 SJ4.1 | IC2.24 41.6,33.76 44.77,33.76 45.14,33.39 48.42,33.39 49.35,34.31 52.63,34.31 52.65,34.29 53.52,34.29 | U2.5 21.89,47.12 SJ4.1 | C7.1 24.73,46.27 C8.1 25.45,46.99 36.49,46.99 37.01,46.48 37.64,46.48 | SJ4.1 17.84,45.97 | 53.52,34.29 53.52,33.62 R7.2 | 54.27,35.54 53.52,34.79 53.52,34.29
  Top 0.305: 54.27,35.54 56.44,37.71 56.44,42.55 52.61,46.38 38.03,46.38 37.74,46.38 37.64,46.48
  Top 0.406: U2.5 C8.1
!RESET
  Top 0.254: IC2.18 40.7,29.87 41.1,29.47 41.1,27.45 TP7.P$1
ADDR0
  Top 0.254: IC2.14 38.21,28.66 SJ8.1
ADDR1
  Top 0.254: IC2.13 37.71,28.9 37.39,28.58 36.01,28.58 SJ9.1
ADDR2
  Top 0.254: IC2.12 35.88,30.62 33.25,27.99 SJ1.1
ADDR3
  Top 0.254: IC2.11 34.41,31.12 SJ2.1
ADDR4
  Top 0.254: IC2.10 34.35,31.62 33.71,32.26 33.31,32.26 SJ3.1
COL0  (via drill 0.5)
  Top 0.254: IC2.1 40.21,33.94 40.49,34.21 44.96,34.21 45.33,33.84 47.14,33.84 v47.53,34.23 47.55,34.26 TP11.P$1
  Bottom 0.254: U$4.P$1 47.53,50.87 47.53,37.47 | 47.53,37.47 v47.53,34.23 47.53,22.47 | 47.53,22.47 47.53,7.97 48.03,7.47 U$26.P$1 | U$12.P$1 47.53,22.47 | U$8.P$1 47.53,37.47
COL1  (via drill 0.5)
  Top 0.254: IC2.5 38.21,34.58 37.87,34.93 36.45,34.93 36.32,35.05 | v32.53,36.58 34.79,36.58 36.32,35.05 | TP12.P$1 36.32,35.05
  Bottom 0.254: U$5.P$1 32.53,50.87 32.53,48.3 34.09,46.74 34.09,43.69 32.53,42.12 32.53,37.59 | U$23.P$1 33.2,22.47 | 33.2,22.47 33.2,16.32 33.81,15.71 33.81,14.23 33.2,13.63 33.2,8.4 U$27.P$1 | 33.2,22.47 32.53,23.15 v32.53,36.58 32.53,37.59 | U$9.P$1 32.65,37.47 32.53,37.59
COL2  (via drill 0.5)
  Top 0.254: IC2.6 35.34,33.87 33.77,35.43 30.92,35.43 | 30.92,35.43 28.25,35.43 27.18,36.5 v27.03,36.5 | TP13.P$1 30.79,35.56 30.92,35.43
  Bottom 0.254: U$6.P$1 27.03,51.37 27.03,47.8 25.2,45.97 25.2,43.56 26.98,41.78 26.98,37.52 27.03,37.47 | 27.03,37.47 v27.03,36.5 27.03,22.47 | U$10.P$1 27.03,37.47 | U$25.P$1 27.03,22.47 | U$28.P$1 26.45,7.47 27.23,8.26 27.23,9.78 25.07,11.94 25.07,17.65 27.03,19.61 27.03,22.47
COL3  (via drill 0.5)
  Top 0.254: v12.12,28.19 12.5,28.58 12.5,33.91 | 12.5,33.91 v12.5,35.94 13.18,35.94 13.54,35.58 27.34,35.58 28.05,34.87 33.5,34.87 35.25,33.12 IC2.7 | TP14.P$1 12.38,34.04 12.5,33.91
  Bottom 0.254: 12.15,22.47 12.15,7.97 11.65,7.47 U$29.P$1 | U$11.P$1 12.53,37.47 | U$24.P$1 12.15,22.47 | U$7.P$1 11.59,52.47 12.25,51.82 12.25,50.09 9.71,47.55 9.71,42.16 12.53,39.34 12.53,37.47 | 12.53,37.47 12.53,35.97 v12.5,35.94 | 12.15,22.47 12.15,28.17 v12.12,28.19
GND  (via drill 0.5)
  Top 0.254: IC2.23 39.79,32.62 v39.05,31.88
  Top 0.406: C3.1 30.03,5.53 JP3.3
  Bottom 0.203: LED2.4 35.64,51.74 v35.64,51.94
  Bottom 0.254: LED10.4 36.65,21.06 v35.87,21.84 | LED16.4 5.9,6.48 v5.9,6.86 | LED15.4 21.65,6.6 v20.63,7.62 | LED8.4 5.64,36.73 v5.64,37.34 | LED7.4 20.63,36.75 v20.63,37.34 | LED1.4 50.61,51.76 v50.61,52.32 | LED3.4 20.51,51.86 v20.51,52.32 | LED11.4 5.9,21.48 v5.9,21.84 | LED14.4 35.61,6.76 v35.61,8 | LED13.4 50.51,6.86 v50.51,7.37 | LED6.4 35.61,36.76 v35.61,37.21
  other vias: 28.5,53.85 42.47,55.88 50.73,21.72 5.56,52.32 20.56,22.35 43.36,49.53 21.52,45.34 17.64,19.18 16.37,8.13 10.91,15.88 16.57,37.34 25.84,29.21 16.18,34.16 33.46,25.78 29.01,22.61 20.76,42.93 53.94,31.24 43.49,21.84 46.66,7.11 29.13,32.13 29.01,37.47 32.19,51.69 15.8,52.58 13.9,50.67 3.36,19.18 8.06,28.83 28.25,8.64 27.61,11.56 37.9,15.88 52.13,15.62 51.62,28.19 21.65,14.86 28.39,48.13 50.6,36.83 29.01,17.91 10.6,57.15
  pour Top: 60.51,60.45 -0.45,60.45 -0.45,-0.51 60.51,-0.51
  pour Bottom: 60.51,60.45 -0.45,60.45 -0.45,-0.51 60.51,-0.51
INT  (via drill 0.5)
  Top 0.254: JP3.1 36.53,2.54 | 36.53,2.54 51.49,2.54 57.89,8.94 57.89,10.49 55.81,12.57 55.81,15.88 59.03,19.09 v59.03,23.47 57.61,24.89 JP2.1 | v36.53,1.47 36.53,2.54 | v58.53,57.45 v44.53,57.45 35.15,57.45 JP4.1 | IC2.17 39.71,29.12 v40.31,28.52 | R3.1 42.65,44.62 | 42.65,44.62 v43,44.97 | v21.38,1.47 20.88,1.97 8.31,1.97 3.99,6.29 3.99,16.51 1.07,19.43 1.07,24.26 1.71,24.89 JP1.1 | v42.6,42.65 42.6,44.57 42.65,44.62
  Bottom 0.254: v36.53,1.47 34.03,3.97 27.27,3.97 25.08,1.78 21.68,1.78 v21.38,1.47 | v44.53,57.45 44.53,46.5 v43,44.97 | v58.53,57.45 58.29,57.21 58.29,48.36 56.03,46.1 56.03,43.7 58.29,41.44 58.29,35.51 56.03,33.25 56.03,27.09 59.03,24.09 v59.03,23.47 | v42.6,42.65 42.6,36.66 41.85,35.91 41.85,30.06 v40.31,28.52
LED_3V  (via drill 0.5)
  Top 0.254: IC2.2 39.71,34.34 39.98,34.6 39.99,34.6 40.06,34.67 v45.78,34.67 | IC3.2 47.55,50.29 47.17,50.67 v47.17,52.32
  Bottom 0.254: v45.78,34.67 47.07,35.97 47.07,52.22 v47.17,52.32
LED_IN  (via drill 0.5)
  Top 0.254: v46.54,55.25 52.65,55.25 54.16,53.73 54.16,52.78 53.45,52.07 v52.25,52.07 | IC3.4 45.78,51.47 v45.78,52.33
  Bottom 0.254: v45.78,52.33 45.78,54.48 v46.54,55.25 | LED1.1 51.65,52.67 v52.25,52.07
N$1
  Top 0.254: 17.01,45.91 15.38,47.54 | 17.01,45.91 17.33,45.59 17.45,45.72 SJ4.2 | 17.01,45.91 17.01,45.35 16.71,45.04 16.71,43.83 15.95,43.07 15.95,41.84 15.21,41.1 12.76,41.1 R8.2
  Top 0.305: 15.38,47.54 15.38,47.62 R6.2
N$2  (via drill 0.5)
  Top 0.254: D9.C 56.14,48.94 v56.38,49.18
  Bottom 0.254: U$4.P$2 57.03,51.97 57.03,49.82 v56.38,49.18
N$3  (via drill 0.5)
  Top 0.254: D1.C 41.24,48.95 v41.26,48.93
  Bottom 0.254: U$5.P$2 41.84,52.16 41.84,49.51 v41.26,48.93
N$4  (via drill 0.5)
  Top 0.254: D2.C 20.21,50.07 v18.04,50.07
  Bottom 0.254: U$6.P$2 18.03,51.97 18.03,50.08 v18.04,50.07
N$5  (via drill 0.5)
  Top 0.254: D3.C 6.05,47.75 v5.45,47.75
  Bottom 0.254: v5.45,47.75 3.53,49.67 U$7.P$2
N$6  (via drill 0.5)
  Top 0.254: D4.C 54.68,41.75 v55.38,41.75
  Bottom 0.254: U$8.P$2 57.03,37.97 57.03,40.1 v55.38,41.75
N$9  (via drill 0.5)
  Top 0.254: D5.C 41.37,40.96 v41.5,40.84
  Bottom 0.254: v41.5,40.84 41.53,40.8 U$9.P$2
N$11  (via drill 0.5)
  Top 0.254: v37.03,52.23 37.44,52.23 37.59,52.09 38.47,52.09 39.72,53.34 50.98,53.34 51.4,52.92 51.4,51.53 51.95,50.97 53.53,50.97 v54.4,51.84
  Bottom 0.254: LED2.1 36.65,52.61 v37.03,52.23 | v54.4,51.84 53.4,50.85 LED1.3
N$12  (via drill 0.5)
  Top 0.254: v39.53,51.97 38.1,50.55 26.85,50.55 24.82,52.58 23.93,52.58 23.42,52.07 22.26,52.07 v22.03,52.3
  Bottom 0.254: LED3.1 22.03,53.85 v22.03,52.3 | v39.53,51.97 38.4,50.85 LED2.3
N$13  (via drill 0.5)
  Top 0.254: v24.28,51.79 23.67,51.18 15.42,51.18 13.75,52.86 9.24,52.86 8.47,52.09 7.42,52.09 v7.28,52.23
  Bottom 0.254: LED4.1 6.65,52.86 v7.28,52.23 | LED3.3 24.28,51.6 v24.28,51.79
N$14  (via drill 0.5)
  Top 0.254: v52.16,37.48 52.45,37.19 53.63,37.19 54.21,37.77 54.21,39.26 53.72,39.75 39.23,39.75 39.08,39.9 21.93,39.9 21.27,39.24 17.71,39.24 17.07,39.88 16.37,39.88 16.1,39.61 3.98,39.61 3.05,40.53 3.05,41.91 4.45,43.31 4.45,48.95 6.84,51.34 8.9,51.34 v9.53,51.97
  Bottom 0.254: LED5.1 51.65,37.99 v52.16,37.48 | v9.53,51.97 8.4,50.85 LED4.3
N$15  (via drill 0.5)
  Top 0.254: v18.04,40.2 18.8,40.96 D6.C
  Bottom 0.254: 17.91,38.09 17.91,40.08 v18.04,40.2
  Bottom 0.305: U$10.P$2 17.91,38.09
N$16  (via drill 0.5)
  Top 0.254: v37.28,37.36 37.55,37.08 38.54,37.08 38.74,37.29 38.74,37.3 39.67,38.23 50.98,38.23 51.3,37.91 51.3,37.21 51.93,36.58 54.13,36.58 v54.4,36.84
  Bottom 0.254: LED6.1 36.65,37.99 v37.28,37.36 | v54.4,36.84 53.4,35.85 LED5.3
N$17  (via drill 0.5)
  Top 0.254: v39.53,36.97 39,36.45 36.89,36.45 36.39,36.94 36.39,37.83 35.89,38.34 24.69,38.34 23.32,36.96 23.3,36.98 v22.54,36.98
  Bottom 0.254: LED7.1 21.65,37.61 22.28,36.98 v22.54,36.98 | v39.53,36.97 38.4,35.85 LED6.3
N$18  (via drill 0.5)
  Top 0.254: D7.C 6.58,40.71 v5.43,41.85
  Bottom 0.254: U$11.P$2 3.53,39.95 v5.43,41.85
N$19  (via drill 0.5)
  Top 0.254: v7.03,36.97 7.14,37.09 8.47,37.09 9.1,37.72 12.12,37.72 13.77,36.07 23.42,36.07 24.33,36.97 v24.53,36.97
  Bottom 0.254: LED8.1 6.65,37.35 v7.03,36.97 | v24.53,36.97 23.4,35.85 LED7.3
N$20  (via drill 0.5)
  Top 0.254: D8.C 55.27,18.97 v57.53,21.23
  Bottom 0.254: U$12.P$2 57.53,21.47 v57.53,21.23
N$21  (via drill 0.5)
  Top 0.254: v9.41,36.79 9.53,36.67 9.53,29.23 14.15,24.61 50.58,24.61 v52.21,22.97
  Bottom 0.254: LED8.3 9.41,36.73 v9.41,36.79 | LED9.1 51.65,23.53 v52.21,22.97
N$22  (via drill 0.5)
  Top 0.254: D10.C 42.05,18.84 v42.16,18.95
  Bottom 0.254: U$23.P$2 42.16,21.84 v42.16,18.95
N$23  (via drill 0.5)
  Top 0.254: D11.C 15.33,20.39 v17.29,22.35
  Bottom 0.254: U$25.P$2 17.41,22.47 v17.29,22.35
N$24  (via drill 0.5)
  Top 0.254: D12.C 2.53,22.43 v2.53,22.34
  Bottom 0.254: U$24.P$2 2.66,22.47 v2.53,22.34
N$25  (via drill 0.5)
  Top 0.254: D13.C 55.99,11.01 v57.03,9.97
  Bottom 0.254: U$26.P$2 57.03,7.97 v57.03,9.97
N$26  (via drill 0.5)
  Top 0.254: D14.C 41.35,11.01 v41.39,10.96
  Bottom 0.254: U$27.P$2 41.53,10.83 v41.39,10.96
N$27  (via drill 0.5)
  Top 0.254: D15.C v17.02,10.98 v17.03,10.97
  Bottom 0.254: U$28.P$2 17.03,8.97 v17.03,10.97
N$28  (via drill 0.5)
  Top 0.254: D16.C 5.81,11.39 v5.81,12.62
  Bottom 0.254: U$29.P$2 3.36,7.64 3.36,10.16 v5.81,12.62
N$29  (via drill 0.5)
  Top 0.254: v37.03,21.97 38.33,21.97 39.21,22.86 40.19,22.86 42.35,20.7 53.51,20.7 v54.4,21.59
  Bottom 0.254: LED10.1 36.65,22.35 v37.03,21.97 | LED9.3 53.53,20.72 v54.4,21.59
N$30  (via drill 0.5)
  Top 0.254: v39.53,21.97 38.53,20.97 28.87,20.97 27.1,22.74 24.28,22.74 23.73,22.19 23.08,22.19 22.53,22.74 v22.15,22.74
  Bottom 0.254: LED12.1 21.65,23.24 v22.15,22.74 | v39.53,21.97 38.4,20.85 LED10.3
N$31  (via drill 0.5)
  Top 0.254: v6.65,22.97 7.07,22.97 7.96,22.09 8.71,22.09 9.84,23.21 20.88,23.21 21.37,22.72 21.37,22.41 22.31,21.47 24.03,21.47 24.27,21.72 v24.4,21.72
  Bottom 0.254: LED11.1 v6.65,22.98 v6.65,22.97 | LED12.3 v24.4,21.72
N$32  (via drill 0.5)
  Top 0.254: v9.41,21.67 7.42,19.68 7.42,17.65 8.18,16.89 33.58,16.89 37.39,13.08 51.24,13.08 52.51,11.81 52.51,10.39 54.03,8.87 54.03,7.87 53.35,7.19 52.7,7.19 52.42,7.47 v51.9,7.47
  Bottom 0.254: LED13.1 51.65,7.72 v51.9,7.47 | v9.41,21.67 8.46,20.72 LED11.3
N$33  (via drill 0.5)
  Top 0.254: v37.03,7.23 37.27,6.99 38.28,6.99 39.17,7.87 40.31,7.87 42.35,5.84 53.4,5.84 v54.53,6.97
  Bottom 0.254: LED14.1 36.65,7.61 v37.03,7.23 | v54.53,6.97 53.4,5.85 LED13.3
N$34  (via drill 0.5)
  Top 0.254: v39.53,6.97 38.91,6.35 35.36,6.35 33.2,8.51 30.92,8.51 29.9,7.49 24.03,7.49 23.72,7.19 22.31,7.19 v22.03,7.47
  Bottom 0.254: LED15.1 21.65,7.85 v22.03,7.47 | v39.53,6.97 38.4,5.85 LED14.3
N$35  (via drill 0.5)
  Top 0.254: v6.53,7.97 8.79,5.71 23.68,5.71 24.41,6.44 v24.41,6.67
  Bottom 0.254: LED16.1 6.65,8.1 v6.53,7.97 | LED15.3 23.46,5.72 v24.41,6.67
ROW0  (via drill 0.5)
  Top 0.254: D9.A 50.19,47.82 v45.53,47.82 37.45,47.82 D1.A 35.18,50.09 25,50.09 D2.A 23.86,48.45 23.3,47.88 19.36,47.88 17.97,49.26 17.72,49.26 17.28,49.7 11.32,49.7 D3.A 11.87,51.02 11.87,51.31 TP24.P$1 | IC2.3 39.24,33.9 39.24,34.51 39.86,35.13 45.06,35.13 v45.78,35.85
  Bottom 0.254: v45.78,35.85 46.61,36.69 46.61,46.73 v45.53,47.82
ROW1  (via drill 0.5)
  Top 0.254: D6.A 24.06,41.07 24.06,42.04 | 24.06,42.04 24.06,42.08 35.23,42.08 D5.A 37.16,41.78 44.51,41.78 | 50.53,41.78 D4.A | 44.51,41.78 50.53,41.78 | 44.51,41.78 44.51,42.57 v44.78,42.84 | IC2.4 38.74,33.9 38.74,34.66 39.67,35.59 44.28,35.59 v44.66,35.96 | 24.06,42.04 18.75,42.04 17.07,40.36 16.2,40.36 15.91,40.06 9.84,40.06 D7.A | TP8.P$1 50.6,41.85 50.53,41.78
  Bottom 0.254: v44.66,35.96 44.63,35.99 44.63,42.7 v44.78,42.84
ROW2  (via drill 0.5)
  Top 0.254: IC2.8 36.94,32.65 35.07,32.65 33.31,34.41 28.57,34.41 v28.03,33.87 | D8.A 50.23,17.78 37.49,17.78 D10.A 28.11,18.84 v28.03,18.92 27.14,18.03 20.38,18.03 | D12.A 9.46,18.03 12.88,18.03 | 12.88,18.03 20.38,18.03 | D11.A 12.79,18.13 12.88,18.03 | TP9.P$1 20.63,18.29 20.38,18.03
  Bottom 0.254: v28.03,33.87 v28.03,18.92
ROW3  (via drill 0.5)
  Top 0.254: D14.A 36.35,12.19 | 36.35,12.19 36.35,12.47 34.98,13.84 33.58,13.84 32.43,12.69 v30.28,12.69 30.27,12.7 TP10.P$1 19.47,12.69 13.55,12.69 D15.A 11.8,11.02 D16.A | D13.A 50.03,12.19 36.35,12.19 | IC2.9 34.95,32.12 33.57,33.5 v30.27,33.5
  Bottom 0.254: v30.28,12.69 30.25,12.72 30.25,33.48 v30.27,33.5
SCL  (via drill 0.5)
  Top 0.254: JP4.4 27.49,54.93 26.53,53.97 23.43,53.97 22.15,55.24 v22.15,57.53 | v6.28,31.88 3.23,31.88 JP1.4 | JP3.4 27.23,2.79 27.23,4.15 v28.63,5.54 | v34.6,11.68 33.96,11.05 v31.04,11.05 | v46.13,26.67 47.94,26.67 53.4,32.13 57.08,32.13 JP2.4 | X2.4 14.17,32.91 v13.77,32.51 | v5.39,46.1 Q1.3 6.93,44.8 10.33,41.4 R8.1
  Bottom 0.254: v34.6,11.68 35.36,12.45 38.54,12.45 46.31,20.22 46.31,26.5 v46.13,26.67 | 10.72,31.24 6.91,31.24 v6.28,31.88 6.28,32.38 2.6,36.07 2.6,42.04 4.37,43.81 4.37,45.97 | 10.72,31.24 14.97,27 14.97,17.52 13.65,16.2 13.65,14.15 14.28,13.51 14.28,2.92 14.91,2.29 24.94,2.29 28.23,5.57 28.6,5.57 v28.63,5.54 28.63,6.04 30.28,7.69 30.28,10.29 v31.04,11.05 | v22.15,57.53 21.65,58.04 4.5,58.04 1.45,54.99 1.45,49.4 4.37,46.48 4.37,45.97 | v13.77,32.51 12.5,31.24 10.72,31.24 | 4.37,45.97 4.5,46.1 v5.39,46.1
SCL_3V  (via drill 0.5)
  Top 0.254: IC2.16 39.24,29.84 39.24,26.09 39.58,25.76 41.17,25.76 42.6,27.19 v42.6,27.94 | v25.96,41.15 33.88,41.15 v33.96,41.24 | R5.1 8.93,48.45 Q1.2 8,46.12 8,44.38 9.96,42.42 13.39,42.42 v13.64,42.16
  Bottom 0.254: v33.96,41.24 36.16,43.43 43.03,43.43 43.45,43 43.45,36.87 42.41,35.82 42.41,28.51 42.6,28.33 v42.6,27.94 | v25.96,41.15 25.05,41.15 22.26,43.94 16.76,43.94 15.87,43.05 14.66,43.05 13.77,42.16 v13.64,42.16
SDA  (via drill 0.5)
  Top 0.254: JP4.5 23.8,58.55 5.01,58.55 1.45,54.99 1.45,48.77 3.99,46.23 3.99,43.56 2.6,42.16 JP1.5 5.14,35.05 v8.06,32.13 | v15.42,3.18 16.06,2.54 JP3.5 | JP2.5 55.88,33.48 54.78,33.48 54.59,33.28 54.59,32.69 54.49,32.59 53.21,32.59 48.18,27.56 45.65,27.56 45.01,26.92 v45.01,26.67 | X2.3 22.55,30.62 v21.77,29.85 | v15.04,42.04 13.26,43.81 13.26,45.58 Q2.3 12.74,46.94 R6.1 | v34.23,12.94 33.2,11.9 30.12,11.9 v29.39,11.18
  Bottom 0.254: v15.04,42.04 13.64,40.64 13.64,34.54 | 17.45,29.72 17.45,26.42 15.42,24.38 15.42,16.76 16.57,15.62 16.57,14.1 15.42,12.95 v15.42,3.18 15.85,2.74 24.64,2.74 29.19,7.29 29.19,10.97 v29.39,11.18 | 17.45,29.72 17.45,30.73 13.64,34.54 | 13.64,34.54 11.23,32.13 v8.06,32.13 | v21.77,29.85 21.65,29.72 17.45,29.72 | v45.01,26.67 45.85,25.83 45.85,20.66 38.27,13.08 34.38,13.08 v34.23,12.94
SDA_3V  (via drill 0.5)
  Top 0.254: IC2.15 38.71,25.86 39.27,25.3 41.87,25.3 v42.73,26.16 | v26.22,49.09 26.41,49.28 v33.58,49.28 | R4.1 10.74,44.9 Q2.2 12.09,45.15 v12.36,44.89
  Bottom 0.254: v42.73,26.16 42.85,26.16 43.49,26.8 43.49,28.34 42.87,28.96 42.87,35.51 43.92,36.56 43.92,43.18 43.16,43.94 37.52,43.94 34.55,46.91 34.55,46.92 33.58,47.89 v33.58,49.28 | v12.36,44.89 12.36,44.72 13.57,43.51 15.68,43.51 16.57,44.4 21.97,44.4 26.22,48.64 v26.22,49.09
SWCLK
  Top 0.254: IC2.19 41.98,30.62 43.74,32.38 46.62,32.38 TP5.P$1 50.24,30.37 52,32.13 52,33.44 R7.1
SWDIO
  Top 0.254: IC2.20 41.83,31.12 43.55,32.84 49.8,32.84 TP6.P$1
VIN  (via drill 0.5)
  Top 0.406: v23.41,22.97 23.41,23.97 | IC3.5 43.74,51.6 v43.74,52.45 | v43.74,54.99 43.74,53.97 | v31.55,25.53 31.3,25.27 27.87,25.27 24.55,28.59 X2.2 | U2.1 19.43,46.17 19.11,45.85 19.11,44.32 | 19.11,44.32 20.18,44.32 U2.3 | 19.11,44.32 SJ4.3 17.84,42.29 v16.82,41.28
  Top 0.61: 23.4,9.98 v32.05,9.98 34.65,9.98 35.16,9.47 38.03,9.47 | 38.03,9.47 52.53,9.47 53.03,8.97 v53.03,7.97 | 38.28,38.97 31.32,38.97 v31.17,39.12 23.54,39.12 23.15,38.73 v23.15,37.97 22.83,38.3 20.23,38.3 20.03,38.1 17.71,38.1 16.71,39.09 | 38.28,38.97 52.26,38.97 53.26,37.97 v53.28,37.97 | 23.4,9.98 v23.4,7.97 | 23.4,53.22 26.28,53.22 28.17,51.33 v30.03,51.33 30.37,51.33 32.57,53.53 | v8.53,7.97 8.53,8.47 9.53,9.47 v13.01,9.47 17.91,9.47 18.42,9.98 23.4,9.98 | 38.03,9.47 v38.03,7.97 | 31.4,23.97 23.41,23.97 13.03,23.97 | 13.03,23.97 8.56,23.97 | v12.95,24.05 13.03,23.97 | 31.4,23.97 v31.55,23.82 | v31.53,7.6 32.5,6.62 C3.2 32.5,2.61 JP3.2 | v8.03,37.97 v8.04,37.97 9.04,38.97 16.59,38.97 16.71,39.09 | 8.56,23.97 8.4,23.81 v8.4,22.97 | v8.15,52.97 8.15,53.1 9.27,54.22 22.14,54.22 23.14,53.22 23.4,53.22 | v53.03,52.97 53.01,52.97 52.01,53.97 43.74,53.97 37.9,53.97 38.03,53.85 | 23.4,53.22 v23.15,52.97 | 38.03,53.85 v38.03,52.97 | JP2.2 53.73,27.43 53.08,26.78 C1.2 53.53,25.58 v53.53,22.97 53.18,22.62 53.18,22.57 52.61,22.01 51.8,22.01 51.13,22.68 51.11,22.68 50.3,23.49 38.95,23.49 38.43,22.97 v38.03,22.97 37.03,23.97 31.4,23.97 | 38.28,38.97 v38.28,37.97 | 8.56,23.97 8.56,25.08 C2.2 8.12,25.21 5.9,27.43 JP1.2 | 32.57,53.53 JP4.2 | 32.57,53.53 33.71,53.53 C4.2 34.03,53.85 38.03,53.85 | 16.71,39.09 v16.69,39.09
  Bottom 0.406: LED16.2 8.4,8.1 v8.53,7.97 | v53.03,7.97 53.4,8.35 LED13.2 | v43.74,52.45 v43.74,54.99 | v16.82,41.28 16.82,39.22 v16.69,39.09 | LED11.2 v8.4,22.97
  Bottom 0.61: v53.53,22.97 53.53,24.1 LED9.2 | LED1.2 53.4,53.35 v53.03,52.98 v53.03,52.97 | LED14.2 38.4,8.35 v38.03,7.97 | LED10.2 38.4,23.35 v38.03,22.97 | v12.95,24.05 13.01,23.99 v13.01,9.47 | v31.55,23.82 v31.55,25.53 31.55,38.74 v31.17,39.12 30.03,40.26 v30.03,51.33 | LED7.2 23.4,38.22 v23.15,37.97 | LED8.2 8.03,38.85 v8.03,37.97 | LED15.2 v23.4,7.97 | LED4.2 8.4,53.22 v8.15,52.97 | LED3.2 23.4,53.23 v23.15,52.97 | LED2.2 38.4,53.35 v38.03,52.97 | LED5.2 53.28,39.1 v53.28,37.97 | LED12.2 v23.4,22.98 v23.41,22.97 | LED6.2 38.28,39.1 v38.28,37.97 | v31.53,7.6 31.53,9.46 v32.05,9.98

### Text on the board
tPlace: 4x4 Elastomer / Buttons+LEDs | SDA | SCL | GND | VIN | INT | Tile together w/ / unique addrs | 3V | Vi2c | Vin | Adafruit NeoTrellis 4x4 | SDA | SDA | SCL | SDA | Vin | GND | GND | SCL | SCL | A4 | GND | GND | A3 | VIN | VIN | A2 | INT | INT | A1 | A0 | GND | VIN | SDA | SCL | INT
bPlace: 4 | 3 | 2 | 1 | 8 | 7 | 6 | 5 | 12 | 11 | 10 | 9 | 16 | 15 | 13 | 14